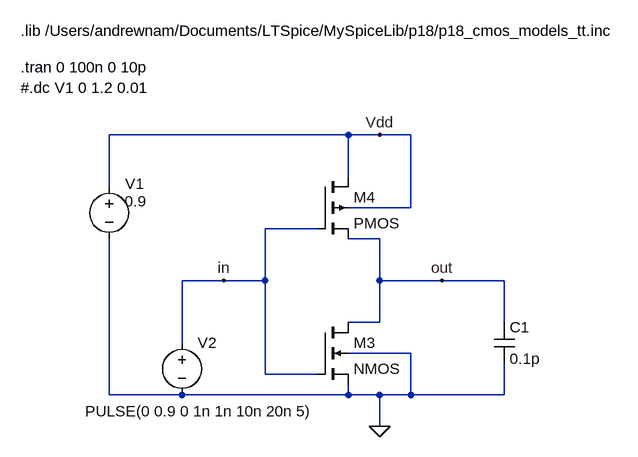
[diagram p0: schematic fig01_inverter.asc]
fig01_inverter.asc, the LTspice schematic file:
Version 4
SHEET 1 1348 680
WIRE 144 -464 -224 -464
WIRE 192 -464 144 -464
WIRE 240 -464 192 -464
WIRE 144 -400 144 -464
WIRE -224 -384 -224 -464
WIRE 240 -352 240 -464
WIRE 240 -352 144 -352
WIRE 96 -320 16 -320
WIRE 192 -304 144 -304
WIRE -48 -240 -112 -240
WIRE 16 -240 16 -320
WIRE 16 -240 -48 -240
WIRE 192 -240 192 -304
WIRE 288 -240 192 -240
WIRE 384 -240 288 -240
WIRE 192 -176 192 -240
WIRE 192 -176 144 -176
WIRE 384 -176 384 -240
WIRE -112 -144 -112 -240
WIRE 240 -128 144 -128
WIRE 16 -96 16 -240
WIRE 96 -96 16 -96
WIRE -224 -64 -224 -304
WIRE -112 -64 -224 -64
WIRE 144 -64 144 -80
WIRE 144 -64 -112 -64
WIRE 192 -64 144 -64
WIRE 240 -64 240 -128
WIRE 240 -64 192 -64
WIRE 384 -64 384 -112
WIRE 384 -64 240 -64
WIRE 192 -16 192 -64
FLAG -48 -240 in
FLAG 288 -240 out
FLAG 192 -464 Vdd
FLAG 192 -16 0
SYMBOL voltage -224 -400 R0
WINDOW 0 39 27 Bottom 2
WINDOW 3 24 38 Left 2
SYMATTR InstName V1
SYMATTR Value 0.9
SYMBOL cap 368 -176 R0
SYMATTR InstName C1
SYMATTR Value 0.1p
SYMBOL voltage -112 -160 R0
WINDOW 3 -149 121 Left 2
SYMATTR Value PULSE(0 0.9 0 1n 1n 10n 20n 5)
SYMATTR InstName V2
SYMBOL nmos4 96 -176 R0
SYMATTR InstName M3
SYMATTR Value2 l=0.18u w=10u
SYMBOL pmos4 96 -400 R0
SYMATTR InstName M4
SYMATTR Value2 l=0.18u w=30u
TEXT -360 -624 Left 2 !.lib /Users/andrewnam/Documents/LTSpice/MySpiceLib/p18/p18_cmos_models_tt.inc
TEXT -360 -568 Left 2 !.tran 0 100n 0 10p\n#.dc V1 0 1.2 0.01

The netlist it stands for:
* fig01_inverter.asc
V1 Vdd 0 0.9
C1 out 0 0.1p
V2 in 0 PULSE(0 0.9 0 1n 1n 10n 20n 5)
M3 out in 0 0 NMOS l=0.18u w=10u
M4 Vdd in out Vdd PMOS l=0.18u w=30u
.model NMOS NMOS
.model PMOS PMOS
.lib standard.mos
.lib /Users/andrewnam/Documents/LTSpice/MySpiceLib/p18/p18_cmos_models_tt.inc
.tran 0 100n 0 10p
#.dc V1 0 1.2 0.01
.backanno
.end